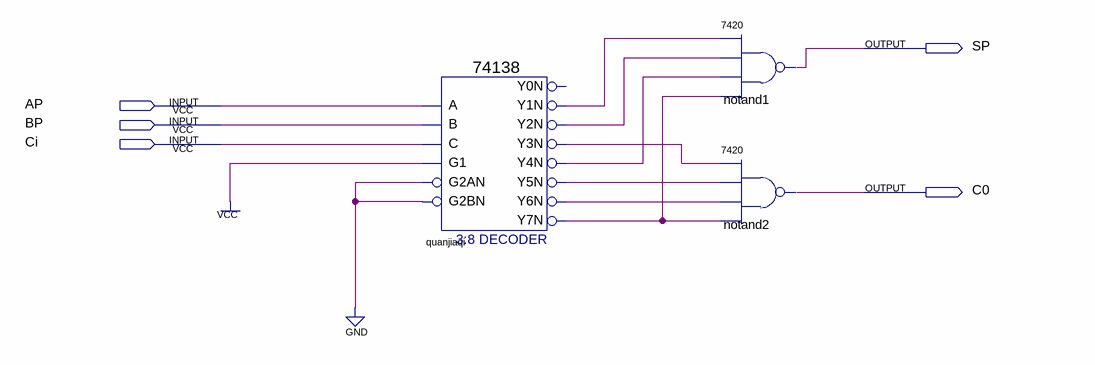
[diagram p0: schematic sheet]
// Quartus schematic 21.bdf as structural Verilog: 3 symbols, 5 pins
module \21  (
  input  AP,
  input  BP,
  input  Ci,
  output SP,
  output C0
);

  wire quanjiaqi_y1n, quanjiaqi_y2n, quanjiaqi_y3n, quanjiaqi_y4n, quanjiaqi_y5n, quanjiaqi_y6n,
       quanjiaqi_y7n;

  \74138  quanjiaqi (
    .A(AP), .B(BP), .G1(1'b1), .C(Ci), .G2AN(1'b0), .G2BN(1'b0), .Y1N(quanjiaqi_y1n), .Y2N(quanjiaqi_y2n),
    .Y3N(quanjiaqi_y3n), .Y4N(quanjiaqi_y4n), .Y5N(quanjiaqi_y5n), .Y6N(quanjiaqi_y6n), .Y7N(quanjiaqi_y7n));  // open: Y0N
  \7420  notand1 (.\4 (quanjiaqi_y4n), .\2 (quanjiaqi_y1n), .\3 (quanjiaqi_y2n), .\5 (quanjiaqi_y7n), .\1 (SP));
  \7420  notand2 (.\4 (quanjiaqi_y6n), .\2 (quanjiaqi_y3n), .\3 (quanjiaqi_y5n), .\5 (quanjiaqi_y7n), .\1 (C0));
endmodule
